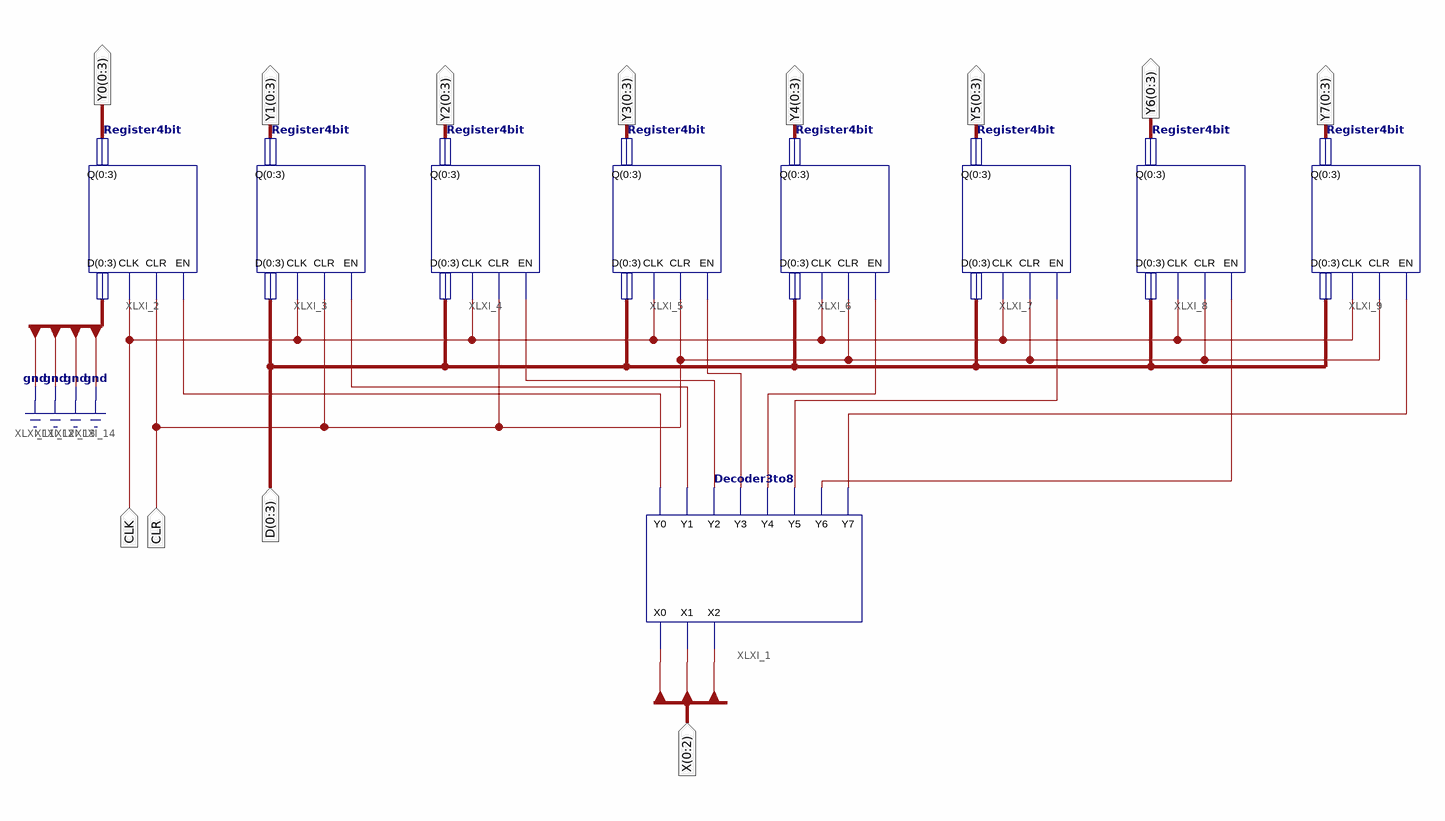
[diagram p0: schematic sheet 1]
// Xilinx ISE schematic RegisterBank.sch (spartan3e) as structural Verilog: 9 symbols, 12 ports
module RegisterBank (
  input  CLK,
  input  CLR,
  input  [0:2] X,
  input  [0:3] D,
  output [0:3] Y1,
  output [0:3] Y2,
  output [0:3] Y3,
  output [0:3] Y4,
  output [0:3] Y5,
  output [0:3] Y7,
  output [0:3] Y6,
  output [0:3] Y0
);

  wire XLXN_2, XLXN_3, XLXN_4, XLXN_5, XLXN_6, XLXN_7, XLXN_8, XLXN_9;

  Decoder3to8 XLXI_1 (
    .X0(X[2]), .X1(X[1]), .X2(X[0]), .Y0(XLXN_2), .Y1(XLXN_3), .Y2(XLXN_4), .Y3(XLXN_5), .Y4(XLXN_6),
    .Y5(XLXN_7), .Y6(XLXN_8), .Y7(XLXN_9));
  Register4bit XLXI_3 (.CLK(CLK), .CLR(CLR), .D(D), .EN(XLXN_3), .Q(Y1));
  Register4bit XLXI_4 (.CLK(CLK), .CLR(CLR), .D(D), .EN(XLXN_4), .Q(Y2));
  Register4bit XLXI_5 (.CLK(CLK), .CLR(CLR), .D(D), .EN(XLXN_5), .Q(Y3));
  Register4bit XLXI_6 (.CLK(CLK), .CLR(CLR), .D(D), .EN(XLXN_6), .Q(Y4));
  Register4bit XLXI_7 (.CLK(CLK), .CLR(CLR), .D(D), .EN(XLXN_7), .Q(Y5));
  Register4bit XLXI_8 (.CLK(CLK), .CLR(CLR), .D(D), .EN(XLXN_8), .Q(Y6));
  Register4bit XLXI_9 (.CLK(CLK), .CLR(CLR), .D(D), .EN(XLXN_9), .Q(Y7));
  Register4bit XLXI_2 (.CLK(CLK), .CLR(CLR), .D(4'b0000), .EN(XLXN_2), .Q(Y0));
endmodule
